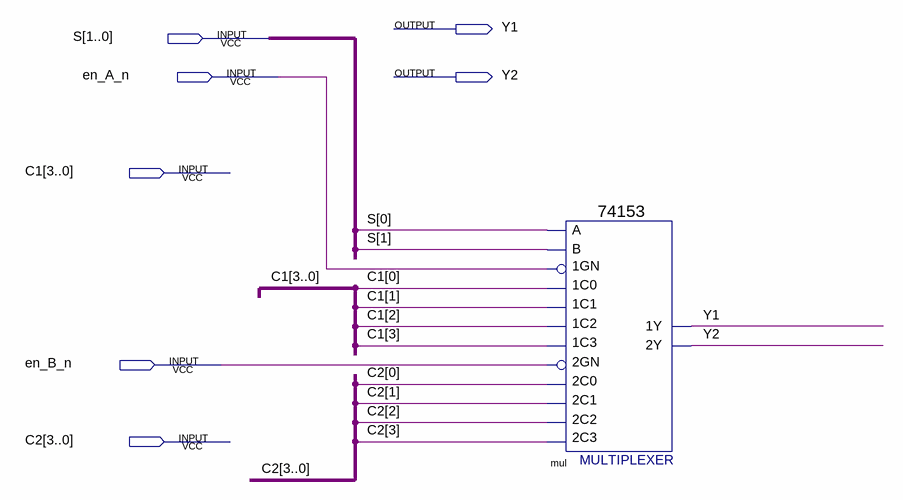
[diagram p0: schematic sheet]
// Quartus schematic TTL74153.bdf as structural Verilog: 1 symbols, 7 pins
module TTL74153 (
  input  [1:0] S,
  input  en_A_n,
  input  [3:0] C1,
  input  en_B_n,
  input  [3:0] C2,
  output Y1,
  output Y2
);

  \74153  mul (
    .\1C1 (C1[1]), .\1GN (en_A_n), .\1C0 (C1[0]), .\2C0 (C2[0]), .\2GN (en_B_n), .\2C2 (C2[2]),
    .\1C2 (C1[2]), .\1C3 (C1[3]), .B(S[1]), .A(S[0]), .\2C1 (C2[1]), .\2C3 (C2[3]), .\1Y (Y1), .\2Y (Y2));
endmodule
